# EAGLE schematic DriveBot (EAGLE 5.11)
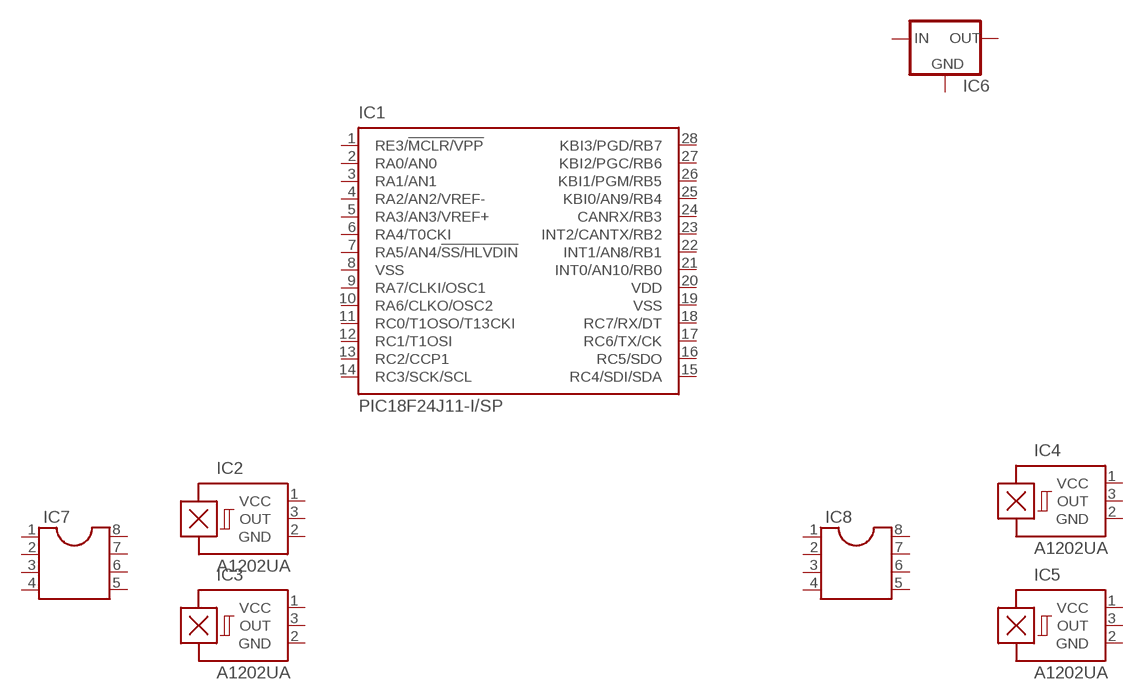
[diagram p0: schematic, sheet 1]

## Parts
IC1  PIC18F24J11-I/SP  PIC18F2480-I/SP  [DIL28-3]
IC2  A1202UA  [SIP3-UA]
IC3  A1202UA  [SIP3-UA]
IC4  A1202UA  [SIP3-UA]
IC5  A1202UA  [SIP3-UA]
IC6  78LXX  [78LXX]
IC7  DIL8S  [SOCKET-08]
IC8  DIL8S  [SOCKET-08]
Unconnected: IC1.1(RE3/!MCLR/VPP) IC1.2(RA0/AN0) IC1.3(RA1/AN1) IC1.4(RA2/AN2/VREF-) IC1.5(RA3/AN3/VREF+) IC1.6(RA4/T0CKI) IC1.7(RA5/AN4/!SS/HLVDIN) IC1.9(RA7/CLKI/OSC1) IC1.10(RA6/CLKO/OSC2) IC1.11(RC0/T1OSO/T13CKI) IC1.12(RC1/T1OSI) IC1.13(RC2/CCP1) IC1.14(RC3/SCK/SCL) IC1.15(RC4/SDI/SDA) IC1.16(RC5/SDO) IC1.17(RC6/TX/CK) IC1.18(RC7/RX/DT) IC1.21(INT0/AN10/RB0) IC1.22(INT1/AN8/RB1) IC1.23(INT2/CANTX/RB2) IC1.24(CANRX/RB3) IC1.25(KBI0/AN9/RB4) IC1.26(KBI1/PGM/RB5) IC1.27(KBI2/PGC/RB6) IC1.28(KBI3/PGD/RB7) IC2.3(OUT) IC3.3(OUT) IC4.3(OUT) IC5.3(OUT) IC6.GND IC6.IN IC6.OUT IC7.1 IC7.2 IC7.3 IC7.4 IC7.5 IC7.6 IC7.7 IC7.8 IC8.1 IC8.2 IC8.3 IC8.4 IC8.5 IC8.6 IC8.7 IC8.8

## Power pins joined to a net without a drawn wire
GND: IC2.2(GND) IC3.2(GND) IC4.2(GND) IC5.2(GND)
VCC: IC2.1(VCC) IC3.1(VCC) IC4.1(VCC) IC5.1(VCC)
VDD: IC1.20(VDD)
VSS: IC1.8(VSS) IC1.19(VSS)

## Library data of the parts
IC1 = microchip:PIC18F2*80: 28-Pin Enhanced Flash Microcontrollers with ECAN(TM) Technology 10-Bit A/D and nanoWatt Technology Source: http://www.microchip.com .. 39637a.pdf; MF: MICROCHIP; MPN: PIC18F2480-I/SP; OC_FARNELL: 9321217; OC_NEWARK: 71J7237
IC2-IC5 = allegro:A12*?: Hall-effect bipolar switch Source: http://www.allegromicro.com/en/Products/Part_Numbers/1202/1202.pdf; OC_FARNELL: unknown; OC_NEWARK: unknown
IC6 = v-reg:78LXX: VOLTAGE REGULATOR
IC7 IC8 = ic-package:DIL8: Dual In Line / Socket